# Altium project M_ruler_v1.PrjPcb
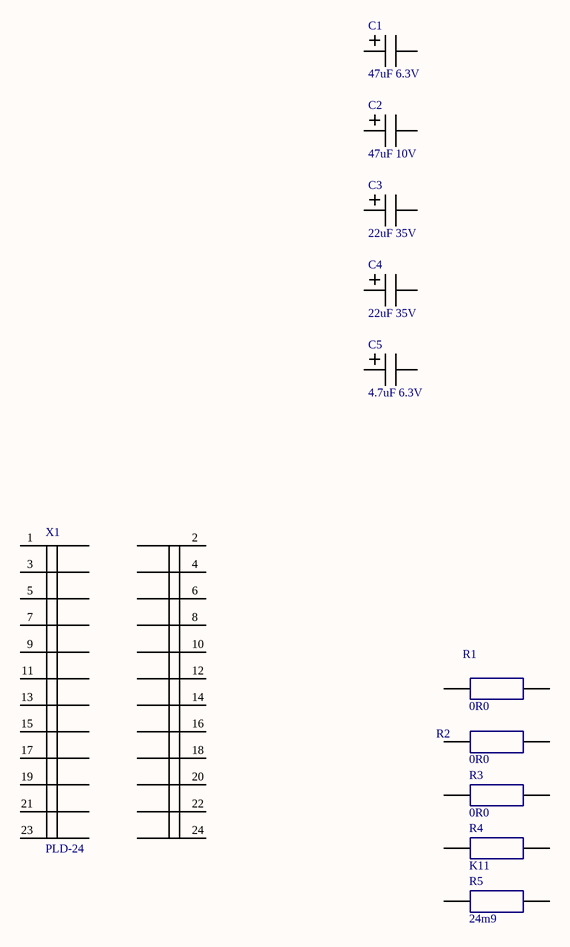
[diagram p0: Sheet1.SchDoc]
1 sheet, 11 parts. Net scope: global (net labels, ports and power ports of the same name join across sheets).
Board file: PCB1.PcbDoc

## Sheet Sheet1.SchDoc
size A4

### Parts
C1  value 47uF 6.3V  [Case A]  (hidden comment: J476)
C2  value 47uF 10V  [Case B]  (hidden comment: A476)
C3  value 22uF 35V  [Case C]  (hidden comment: 22 35V)
C4  value 22uF 35V  [Case D]  (hidden comment: 22 35V)
C5  value 4.7uF 6.3V  [Case R]  (hidden comment: 475J)
R1  value 0R0  [R0402]  (hidden comment: 000)
R2  value 0R0  [R0603 5%]  (hidden comment: 000)
R3  value 0R0  [R0805]  (hidden comment: 000)
R4  value K11  [Resistor 1206]  (hidden comment: 111)
R5  24m9  [R2512]
X1  PLD-24  [PLD-24]

### Nets

Not connected (* = marked no-connect by the designer): C1 1 2; C2 1 2; C3 1 2; C4 1 2; C5 1 2; R1 1 2; R2 1 2; R3 1 2; R4 1 2; R5 1 2; X1 1 2 3 4 5 6 7 8 9 10 11 12 13 14 15 16 17 18 19 20 21 22 23 24

### Notes on the sheet
- Title
- Size:
- Date:
- A4
- Number:
- Time:
- Revision:
- Sheet
- of
- File:

### Library data of the parts
C1 = CMP-00155-5: C 47uF x 6.3V; Component Name: Tantalum Capacitor, SMD, Case A, 47uF 6.3V; Marking: J476; Package: Case A
C2 = CMP-00081-4: C 47uF x 10V; Component Name: Tantalum Capacitor, SMD, Case B, 47uF 10V; Marking: A476; Package: Case B
C3 = CMP-00312-5: C 22uF x 35V; Component Name: Tantalum Capacitor, SMD, Case C, 22uF 35V; Marking: 22 35V; Package: Case C
C4 = CMP-00160-4: C 22uF x 35V; Component Name: Tantalum Capacitor, SMD, Case D, 22uF 35V; Marking: 22 35V; Package: Case D
C5 = CMP-00272-3: C 4.7uF x 6.3V; Component Name: Tantalum Capacitor, SMD, Case R, 4.7uF 6.3V; Marking: 475J; Package: Case R
R1 = CMP-00180-5: R 0R0; Component Name: Fixed resistor, SMD, 0402, 0R0 5%; Marking: 000; Package: 0402
R2 = CMP-00039-5: R 0R0; Component Name: Fixed resistor, SMD, 0603, 0R0; Package: 0603; Marking: 000
R3 = CMP-00086-4: R 0R0; Component Name: Fixed resistor, SMD, 0805, 0R0 5%; Marking: 000; Package: 0805
R4 = CMP-00483-5: R K11; Component Name: Fixed resistor, SMD, 1206, K11 5%; Marking: 111; Package: 1206
R5 = CMP-00550-5: R 24m9; Component Name: Fixed resistor, SMD, 2512, 24m9 1%; Value: 24m9; Marking: 24m9; Package: 2512
X1 = CMP-00102-3: Component Name: Connector, PLD-24; Package: PLD-24; Value: PLD-24; ComponentLink1Description: Datasheet; ComponentLink1URL: http://radio18.ru/catalog/docs/414.pdf; Marking: PLD-24